# EAGLE design main_board (EAGLE 8.0.1)
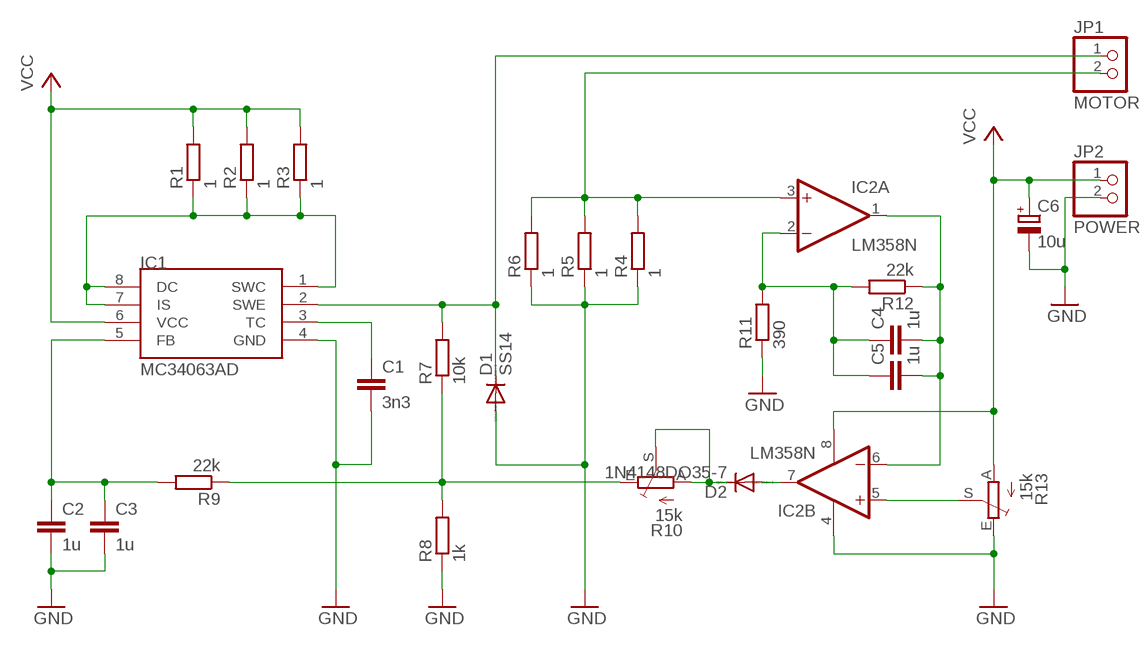
[diagram p0: schematic, sheet 1]

## Parts
C1  3n3  C-EUC0805  [C0805]
C2  1u  C-EUC0805  [C0805]
C3  1u  C-EUC0805  [C0805]
C4  1u  C-EUC0805  [C0805]
C5  1u  C-EUC0805  [C0805]
C6  10u  CPOL-EUCT6032  [CT6032]
D1  SS14  DIODE-DO214AC  [DO214AC]
D2  1N4148DO35-7  [DO35-7]
IC1  MC34063AD  [SOIC8]
IC2  LM358N  [DIL08]
JP1  MOTOR  PINHD-1X2  [1X02]
JP2  POWER  PINHD-1X2  [1X02]
R1  1  R-EU_R0805  [R0805]
R2  1  R-EU_R0805  [R0805]
R3  1  R-EU_R0805  [R0805]
R4  1  R-EU_R0805  [R0805]
R5  1  R-EU_R0805  [R0805]
R6  1  R-EU_R0805  [R0805]
R7  10k  R-EU_R0805  [R0805]
R8  1k  R-EU_R0805  [R0805]
R9  22k  R-EU_R0805  [R0805]
R10  15k  TRIM_EU-CA6V  [CA6V]
R11  390  R-EU_R0805  [R0805]
R12  22k  R-EU_R0805  [R0805]
R13  15k  TRIM_EU-CA6V  [CA6V]

## Nets
GND [power]: C1.2 C2.2 C3.2 C6.- D1.A IC1.4(GND) IC2.4(P:V-) JP2.2 R4.1 R5.1 R6.1 R8.1 R11.1 R13.E
N$1: IC1.1(SWC) IC1.7(IS) IC1.8(DC) R1.1 R2.1 R3.1
N$2: C1.1 IC1.3(TC)
N$3: D2.C R10.A R10.S
N$4 [power]: D1.C IC1.2(SWE) JP1.1 R7.2
N$5: C2.1 C3.1 IC1.5(FB) R9.2
N$6: C4.1 C5.1 IC2.2(A:-IN) R11.2 R12.2
N$7 [power]: IC2.3(A:+IN) JP1.2 R4.2 R5.2 R6.2
N$8: IC2.5(B:+IN) R13.S
N$9: R7.1 R8.2 R9.1 R10.E
N$10: C4.2 C5.2 IC2.1(A:OUT) IC2.6(B:-IN) R12.1
N$12: D2.A IC2.7(B:OUT)
VCC [power]: C6.+ IC1.6(VCC) IC2.8(P:V+) JP2.1 R1.2 R2.2 R3.2 R13.A

## Library data of the parts
C1-C5 = resistor:C-EU: CAPACITOR, European symbol
C6 = rcl:CPOL-EU: POLARIZED CAPACITOR, European symbol
D1 = diode:DIODE-: DIODE
D2 = diode:1N4148: DIODE high speed (Philips)
IC1 = mc34063:MC34063
IC2 = linear:LM358: OP AMP also LM158; LM258; LM2904 Source: http://cache.national.com/ds/LM/LM158.pdf
JP1 JP2 = pinhead:PINHD-1X2: PIN HEADER
R1-R9 R11 R12 = resistor:R-EU_: RESISTOR, European symbol
R10 R13 = pot:TRIM_EU-: POTENTIOMETER

## Net classes
0 default: width 0.6 mm
1 power: width 0.8 mm

## Board
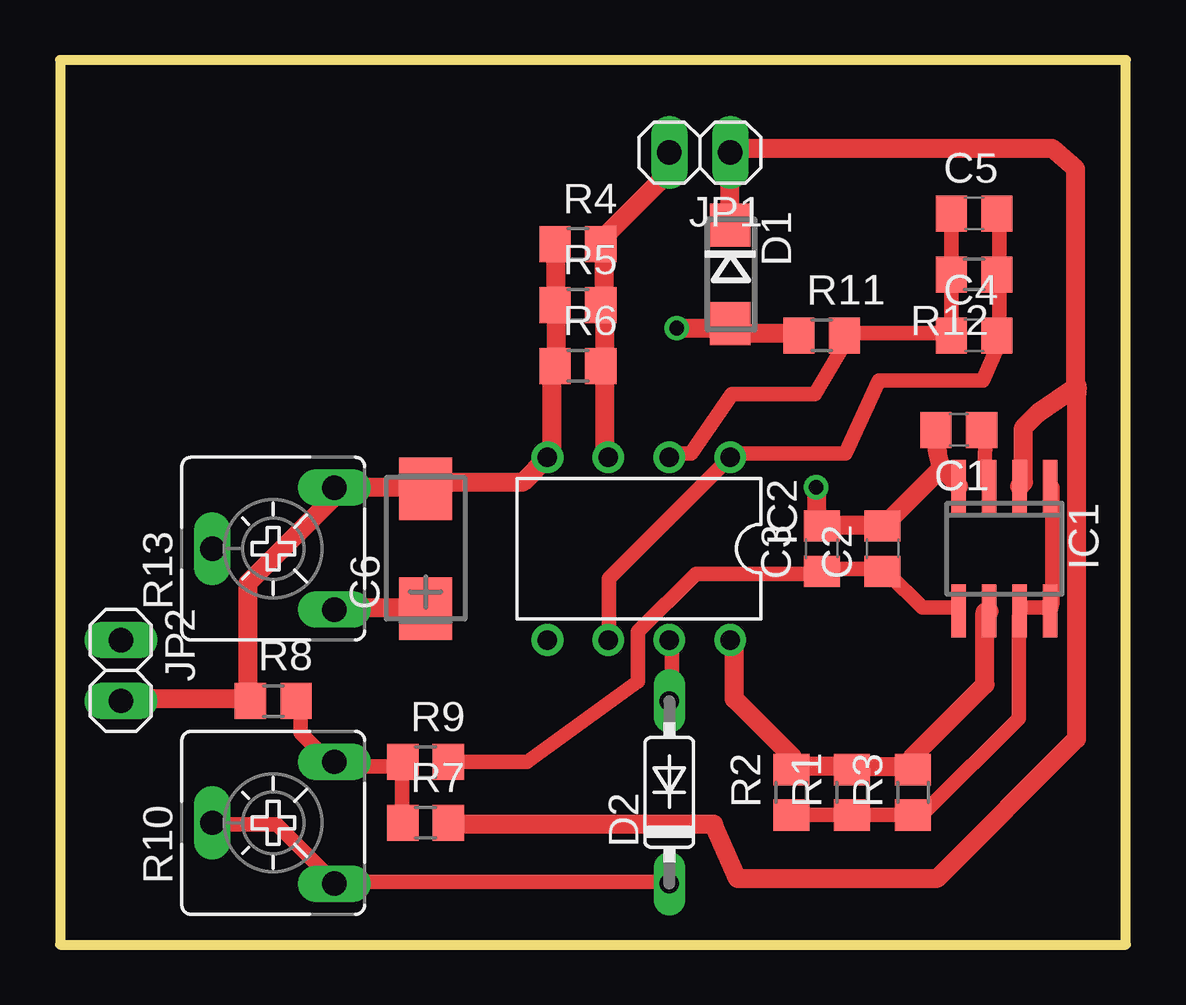
[diagram p1: board, top side]
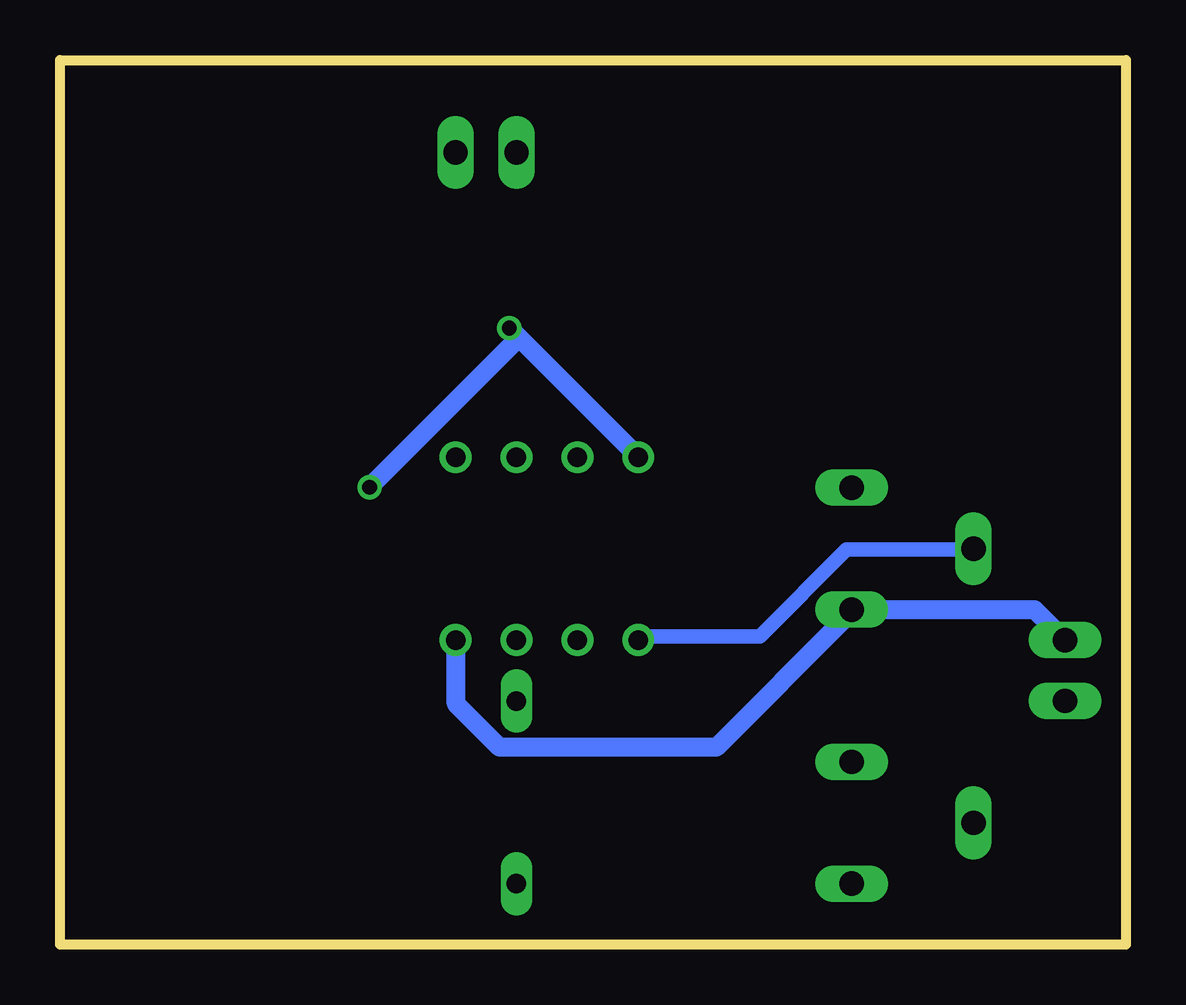
[diagram p2: board, bottom side, seen from below]

Size 44.43 x 36.88 mm. Coordinates in mm from the lower left corner, seen from the top.
Outline: 0,0 44.43,0 44.43,36.88 0,36.88 0,0
Copper layers (1*16): Top 0.035mm / dielectric 1.5mm / Bottom 0.035mm
Design rules "default": minimum track width 10mil, minimum drill 24mil, track to track 8mil, track to pad 8mil, pad to pad 8mil, via to via 8mil, smd to smd 8mil, copper to edge 40mil, drill to drill 8mil, minimum pad ring 10mil, minimum via ring 8mil, stop-mask expansion 4mil, vias tented up to drill 0mil, thermal gap 10mil

### Footprints (pad centres in the part's own frame; a part is rotated, then mirrored left to right if it is on the bottom)
C0805 = smd 1.3 x 1.5: 1 -0.95,0; 2 0.95,0
CT6032 = smd 2.6 x 2.2: + -2.5,0; - 2.5,0
DO214AC = smd 1.8 x 1.7: A 2.05,0; C -2.05,0
DO35-7 = drill 0.813 long: A 3.81,0; C -3.81,0
SOIC8 = smd 0.6 x 2.2: 1 -1.905,-2.6; 2 -0.635,-2.6; 3 0.635,-2.6; 4 1.905,-2.6; 5 1.905,2.6; 6 0.635,2.6; 7 -0.635,2.6; 8 -1.905,2.6
DIL08 = drill 0.813 pad 1.27: 1 -3.81,-3.81; 2 -1.27,-3.81; 3 1.27,-3.81; 4 3.81,-3.81; 5 3.81,3.81; 6 1.27,3.81; 7 -1.27,3.81; 8 -3.81,3.81
1X02 = drill 1.016 long: 1 -1.27,0; 2 1.27,0
R0805 = smd 1.3 x 1.5: 1 -0.95,0; 2 0.95,0
CA6V = drill 1.016 long: A -2.54,-2.54; E 2.54,-2.54; S 0,2.54

### Placement (x,y rotation side)
C1  37.47,21.46 180 top
C2  34.29,16.51 90 top
C3  31.75,16.51 90 top
C4  38.1,25.4 0 top
C5  38.1,30.48 0 top
C6  15.24,16.51 90 top
D1  27.94,27.94 270 top
D2  25.4,6.35 90 top
IC1  39.37,16.51 180 top
IC2  24.13,16.51 180 top
JP1  26.67,33.02 180 top
JP2  2.54,11.43 270 top
R1  33.02,6.35 90 top
R2  30.48,6.35 90 top
R3  35.56,6.35 90 top
R4  21.59,29.21 0 top
R5  21.59,26.67 0 top
R6  21.59,24.13 0 top
R7  15.24,5.08 0 top
R8  8.89,10.16 0 top
R9  15.24,7.62 0 top
R10  8.89,5.08 90 top
R11  31.75,25.4 0 top
R12  38.1,27.94 180 top
R13  8.89,16.51 90 top

### Tracks (layer width: path | path; a pad name or v marks a point on that pad's centre or on a via)
GND  (via drill 0.61)
  Top 0.8: 36.75,19.88 37.35,19.28 IC1.4 | 36.75,19.88 36.58,20.55 36.58,21.49 C1.2 | 36.75,19.88 34.54,17.67 C2.2 34.14,17.47 31.93,17.47 C3.2 31.53,17.67 v31.53,19.08 | R11.1 30.72,25.5 28.31,25.5 28.11,25.7 D1.A 27.71,25.7 v25.7,25.7 | R4.1 20.68,29.12 20.68,26.91 R5.1 20.68,26.51 20.68,24.3 R6.1 20.48,23.89 20.48,20.48 IC2.4 19.28,19.28 15.46,19.28 C6.- 15.06,19.08 11.45,19.08 R13.E 11.45,18.67 7.83,15.06 7.83,10.64 R8.1 7.83,10.24 2.54,10.24 JP2.2
  Bottom 0.8: IC2.4 25.3,25.3 | 25.3,25.3 v25.7,25.7 | 25.3,25.3 v31.53,19.08
N$1
  Top 0.6: R2.1 30.52,5.42 32.93,5.42 R1.1 33.33,5.42 35.54,5.42 R3.1 35.74,5.62 36.14,5.62 39.96,9.44 39.96,13.65 IC1.7 40.16,14.06 41.16,14.06 IC1.8 41.37,14.26 41.37,19.08 IC1.1
N$2
  Top 0.6: C1.1 38.33,21.49 38.59,21.39 38.55,20.28 38.55,19.28 IC1.3
N$3
  Top 0.6: D2.C 25.3,2.61 11.45,2.61 R10.A 11.24,2.81 9.04,5.02 6.43,5.02 R10.S
N$4
  Top 0.8: D1.C 27.91,30.12 27.91,32.93 JP1.1 28.49,33.2 41.36,33.2 42.34,32.34 42.34,23.24 40.76,22.15 | 40.76,22.15 42.4,23.3 42.37,22.82 42.37,8.57 36.55,2.75 28.25,2.75 27.24,5.02 16.27,5.02 R7.2 | 40.76,22.15 40.16,21.55 40.16,19.28 IC1.2
N$5
  Top 0.6: R9.2 16.27,7.63 19.48,7.63 24.1,10.98 24.1,13.05 26.51,15.46 31.73,15.46 C3.1 31.93,15.66 34.14,15.66 C2.1 34.54,15.46 35.94,14.06 37.35,14.06 IC1.5
N$6
  Top 0.6: C5.1 37.15,30.32 37.15,28.11 R12.2 37.15,27.91 37.15,25.7 C4.1 37.15,25.5 32.73,25.5 R11.2 32.73,25.1 31.47,22.95 28.01,22.95 26.3,20.48 25.5,20.48 IC2.2
N$7
  Top 0.8: IC2.3 22.69,20.48 22.69,23.89 R6.2 22.69,24.3 22.69,26.51 R5.2 22.69,26.91 22.69,29.12 R4.2 22.69,29.52 25.3,32.13 25.3,32.93 JP1.2
N$8
  Bottom 0.6: IC2.5 20.28,12.85 15.26,12.85 11.65,16.47 6.43,16.47 R13.S
N$9
  Top 0.6: R7.1 14.26,5.22 14.26,7.43 R9.1 14.06,7.43 11.65,7.43 R10.E 11.24,7.63 10.04,8.84 10.04,10.04 R8.2
N$10
  Top 0.6: C5.2 39.16,30.32 39.16,28.11 R12.1 39.16,27.91 39.16,25.5 C4.2 39.16,25.1 38.47,23.53 34.13,23.53 32.73,20.48 28.11,20.48 IC2.1 27.91,20.28 22.89,15.26 22.89,12.85 IC2.6
N$12
  Top 0.6: D2.A 25.5,10.24 25.5,12.65 IC2.7
VCC
  Top 0.8: IC1.6 38.55,13.86 38.55,10.84 35.54,7.83 R3.2 35.54,7.43 33.33,7.43 R1.2 32.93,7.43 30.52,7.43 R2.2 30.52,7.83 28.11,10.24 28.11,12.65 IC2.8 | C6.+ 15.06,14.06 11.45,14.06 R13.A
  Bottom 0.8: 11.24,13.86 R13.A | IC2.8 27.91,12.65 27.91,10.04 26.1,8.23 17.07,8.23 11.65,13.65 R13.A | R13.A 3.81,13.97 JP2.1